# Altium schematic sheet sanati.SchDoc
size A3
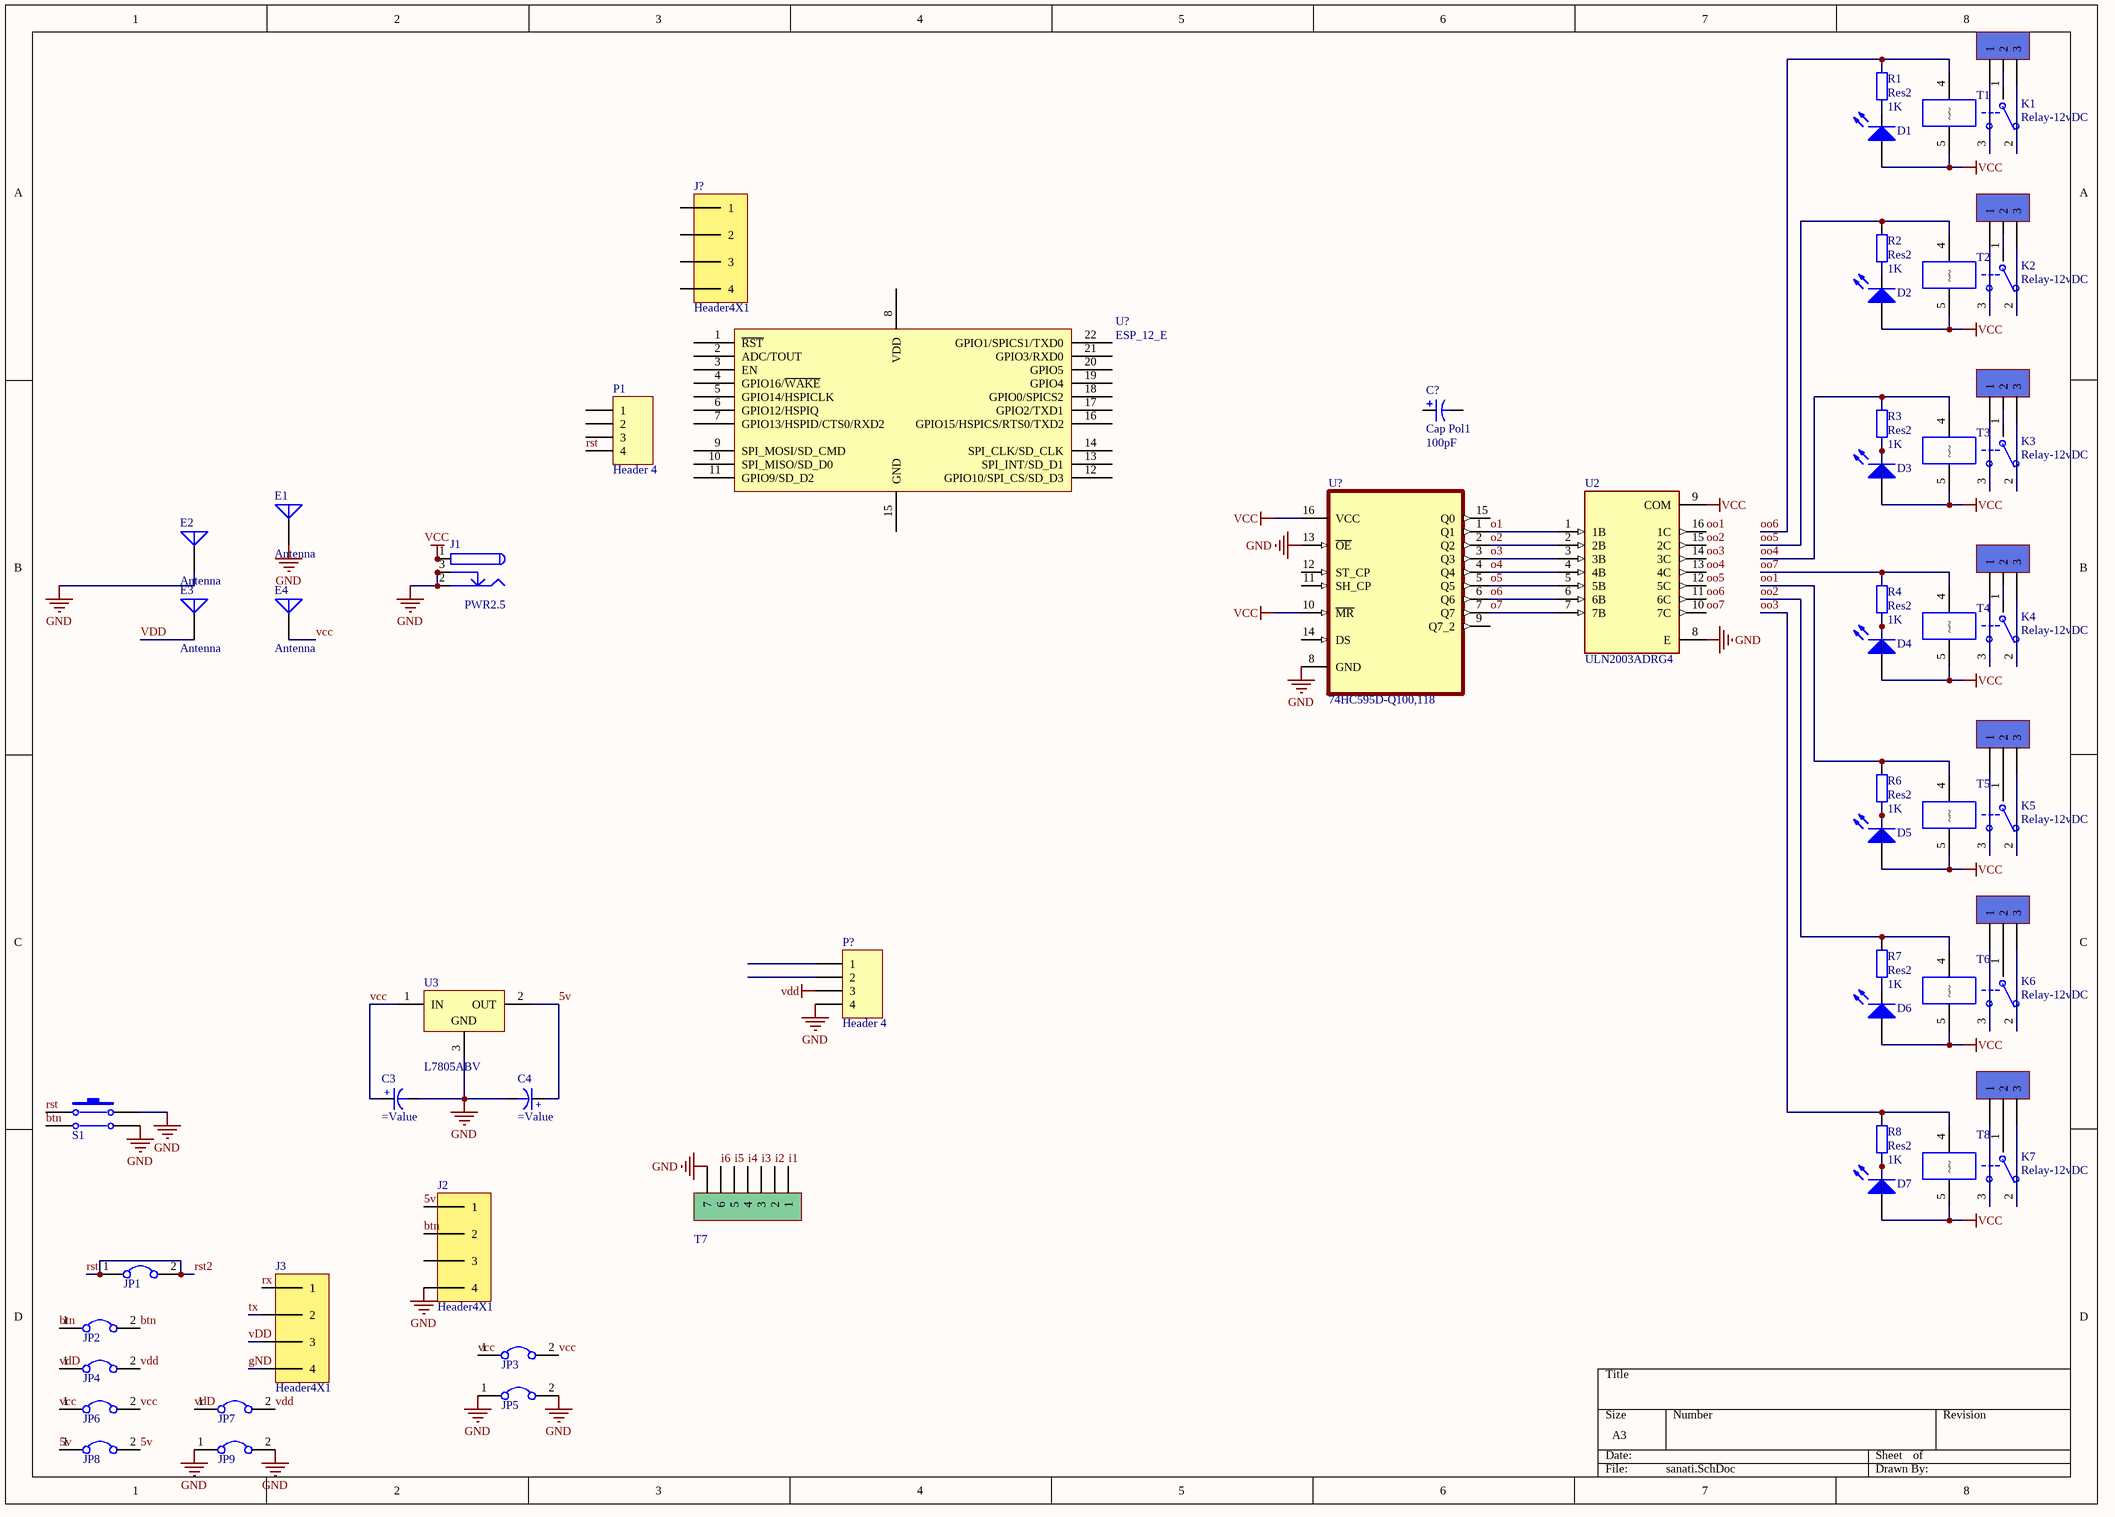
[diagram p0: sanati.SchDoc]

## Parts
(Parts that share a designator on the sheet are numbered #1, #2 ... from top to bottom, then left to right.)
C3  (no value)  [ELEC-CAP-RAD10-20]
C4  (no value)  [ELEC-CAP-RAD10-20]
C?  Cap Pol1  value 100pF  [RB7.6-15]
D1  LED 3mm  [LED-3mm]  (value not drawn)
D2  LED 3mm  [LED-3mm]  (value not drawn)
D3  LED 3mm  [LED-3mm]  (value not drawn)
D4  LED 3mm  [LED-3mm]  (value not drawn)
D5  LED 3mm  [LED-3mm]  (value not drawn)
D6  LED 3mm  [LED-3mm]  (value not drawn)
D7  LED 3mm  [LED-3mm]  (value not drawn)
E1  Antenna  [PIN1]
E2  Antenna  [PIN1]
E3  Antenna  [PIN1]
E4  Antenna  [PIN1]
J1  PWR2.5  [KLD-0202]
J2  Header4X1  [HEADER 4X1]
J3  Header4X1  [HEADER 4X1]
J?  Header4X1  [HEADER 4X1]
JP1  Jumper  [Header 2X1]  (value not drawn)
JP2  Jumper  [Header 2X1]  (value not drawn)
JP3  Jumper  [Header 2X1]  (value not drawn)
JP4  Jumper  [Header 2X1]  (value not drawn)
JP5  Jumper  [Header 2X1]  (value not drawn)
JP6  Jumper  [Header 2X1]  (value not drawn)
JP7  Jumper  [Header 2X1]  (value not drawn)
JP8  Jumper  [Header 2X1]  (value not drawn)
JP9  Jumper  [Header 2X1]  (value not drawn)
K1  Relay-12vDC  [Relays]
K2  Relay-12vDC  [Relays]
K3  Relay-12vDC  [Relays]
K4  Relay-12vDC  [Relays]
K5  Relay-12vDC  [Relays]
K6  Relay-12vDC  [Relays]
K7  Relay-12vDC  [Relays]
P1  Header 4  [HDR1X4]
P?  Header 4  [HDR1X4]
R1  Res2  value 1K  [Res50]
R2  Res2  value 1K  [Res50]
R3  Res2  value 1K  [Res50]
R4  Res2  value 1K  [Res50]
R6  Res2  value 1K  [Res50]
R7  Res2  value 1K  [Res50]
R8  Res2  value 1K  [Res50]
S1  PUSH BUTTON DOUBLE  [PUSH BUTTON]  (value not drawn)
T1  Terminal  [phoenix terminal R 3]  (value not drawn)
T2  Terminal  [phoenix terminal R 3]  (value not drawn)
T3  Terminal  [phoenix terminal R 3]  (value not drawn)
T4  Terminal  [phoenix terminal R 3]  (value not drawn)
T5  Terminal  [phoenix terminal R 3]  (value not drawn)
T6  Terminal  [phoenix terminal R 3]  (value not drawn)
T7  Phoenix terminal  [phoenix terminal 7]  (value not drawn)
T8  Terminal  [phoenix terminal R 3]  (value not drawn)
U2  ULN2003ADRG4  [SOIC127P600X175-16N]
U3  L7805ABV  [TO220ABN]
U?#1  ESP_12_E  [ESP_12_E]
U?#2  74HC595D-Q100,118  [SOIC127P600X175-16N]

## Nets
gND: C3.1(-) C4.1(-) E1.1(A) E2.1(A) J1.2 J1.2A J1.2B J1.3 J1.3A J1.3B J2.4 J3.4 JP5.1 JP5.2 JP9.1 JP9.2 P?.4 S1.2 S1.4 T7.7 U2.8(E) U3.3(GND) U?#2.8(GND) U?#2.13(~{OE})
vcc: C3.2(+) D1.1(A) D2.1(A) D3.1(A) D4.1(A) D5.1(A) D6.1(A) D7.1(A) E4.1(A) J1.1 J1.1A J1.1B JP3.1 JP3.2 JP6.1 JP6.2 K1.5 K2.5 K3.5 K4.5 K5.5 K6.5 K7.5 U2.9(COM) U3.1(IN) U?#2.10(~{MR}) U?#2.16(VCC)
VDD: E3.1(A) J3.3 JP4.1 JP4.2 JP7.1 JP7.2 P?.3
5v: C4.2(+) J2.1 JP8.1 JP8.2 U3.2(OUT)
btn: J2.2 JP2.1 JP2.2 S1.3
i1: T7.1
i2: T7.2
i3: T7.3
i4: T7.4
i5: T7.5
i6: T7.6
o1: U2.1(1B) U?#2.1(Q1)
o2: U2.2(2B) U?#2.2(Q2)
o3: U2.3(3B) U?#2.3(Q3)
o4: U2.4(4B) U?#2.4(Q4)
o5: U2.5(5B) U?#2.5(Q5)
o6: U2.6(6B) U?#2.6(Q6)
o7: U2.7(7B) U?#2.7(Q7)
oo1: K5.4 R6.2 U2.16(1C)
oo2: K6.4 R7.2 U2.15(2C)
oo3: K7.4 R8.2 U2.14(3C)
oo4: K3.4 R3.2 U2.13(4C)
oo5: K2.4 R2.2 U2.12(5C)
oo6: K1.4 R1.2 U2.11(6C)
oo7: K4.4 R4.2 U2.10(7C)
rst: JP1.1 JP1.2 P1.4 S1.1  [also labelled rst2]
rx: J3.1
tx: J3.2
NetD1_2: D1.2(K) R1.1
NetD2_2: D2.2(K) R2.1
NetD3_2: D3.2(K) R3.1
NetD4_2: D4.2(K) R4.1
NetD5_2: D5.2(K) R6.1
NetD6_2: D6.2(K) R7.1
NetD7_2: D7.2(K) R8.1
NetK1_1: K1.1(COM) T1.2
NetK1_2: K1.2(NC) T1.3
NetK1_3: K1.3(NO) T1.1
NetK2_1: K2.1(COM) T2.2
NetK2_2: K2.2(NC) T2.3
NetK2_3: K2.3(NO) T2.1
NetK3_1: K3.1(COM) T3.2
NetK3_2: K3.2(NC) T3.3
NetK3_3: K3.3(NO) T3.1
NetK4_1: K4.1(COM) T4.2
NetK4_2: K4.2(NC) T4.3
NetK4_3: K4.3(NO) T4.1
NetK5_1: K5.1(COM) T5.2
NetK5_2: K5.2(NC) T5.3
NetK5_3: K5.3(NO) T5.1
NetK6_1: K6.1(COM) T6.2
NetK6_2: K6.2(NC) T6.3
NetK6_3: K6.3(NO) T6.1
NetK7_1: K7.1(COM) T8.2
NetK7_2: K7.2(NC) T8.3
NetK7_3: K7.3(NO) T8.1

Not connected (* = marked no-connect by the designer): C? 1 2; J2 3; J? 1 2 3 4; P1 1 2 3; P? 1 2; U?#1 1(~{RST}) 2(ADC/TOUT) 3(EN) 4(GPIO16/~{WAKE}) 5(GPIO14/HSPICLK) 6(GPIO12/HSPIQ) 7(GPIO13/HSPID/CTS0/RXD2) 8(VDD) 9(SPI_MOSI/SD_CMD) 10(SPI_MISO/SD_D0) 11(GPIO9/SD_D2) 12(GPIO10/SPI_CS/SD_D3) 13(SPI_INT/SD_D1) 14(SPI_CLK/SD_CLK) 15(GND) 16(GPIO15/HSPICS/RTS0/TXD2) 17(GPIO2/TXD1) 18(GPIO0/SPICS2) 19(GPIO4) 20(GPIO5) 21(GPIO3/RXD0) 22(GPIO1/SPICS1/TXD0); U?#2 9(Q7_2) 11(SH_CP) 12(ST_CP) 14(DS) 15(Q0)

## Library data of the parts
C3 C4 = Capacitor Electrolytic: Electrolytic Capacitor
C? = Cap Pol1: Polarized Capacitor (Radial); Published: 8-Jun-2000; LatestRevisionDate: 17-Jul-2002; LatestRevisionNote: Re-released for DXP Platform.; PackageReference: RB7.6-15; Publisher: Altium Limited; PackageDescription: Polarized Capacitor (Radial); 2 Leads
D1-D7 = LED 3mm: Typical LED; Designer: Seyed Mohsen Ghasemian; Published: 02/04/2012; PackageReference: LED; Publisher: www.picpars.com; PackageDescription: LED; 2 Leads
E1-E4 = Antenna: Generic Antenna; Published: 24-Mar-1999; LatestRevisionDate: 17-Jul-2002; LatestRevisionNote: Re-released for DXP Platform.; PackageReference: PIN1; Publisher: Altium Limited
J1 = PWR2.5: Low Voltage Power Supply Connector; Published: 17-Dec-2003; DatasheetDocument: 09-May-2002; Publisher: Altium Limited; ComponentLink1Description: Manufacturer Link; ComponentLink1URL: http://domino.kycon.com/internet/Products.html
K1-K7 = Relay-05vDC: Relay-05vDC-240AC 5A; Designer: Seyed Mohsen Ghasemain; ComponentLinkURL: www.picpars.com
P1 P? = Header 4: Header, 4-Pin; LatestRevisionDate: 17-Jul-2002; LatestRevisionNote: Re-released for DXP Platform.; Publisher: Altium Limited
R1-R4 R6-R8 = Res2: Resistor; Published: 8-Jun-2000; LatestRevisionDate: 17-Jul-2002; LatestRevisionNote: Re-released for DXP Platform.; Publisher: Altium Limited; PackageDescription: Axial Device, Thru-Hole; 2 Leads; 0.4 in Pin Spacing
  R1-R4 R6 R7: PackageReference: AXIAL-0.4
  R8: PackageReference: Res50
S1 = PUSH BUTTON DOUBLE: Switch
T1-T6 T8 = Terminal 1*3: phoenix terminal R 3; Designer: Seyed Mohsen Ghasemain; E-mail: picpars@gmail.com; ComponentLinkURL: www.picpars.com
T7 = Phoenix terminal 7: Terminal 7 Pin; Designer: Seyed Mohsen Ghasemain; E-mail: picpars@gmail.com; ComponentLinkURL: www.picpars.com
U2 = ULN2003ADRG4: 50-V, 7-ch darlington transistor array, -20C to 70C 16-SOIC -40 to 70; Price: None; MP: ULN2003ADRG4; Availability: Unavailable; Package: None; Value: *
U3 = L7805ABV: Precision 1A Regulator; Note: Tab is connected to pin 3 (GND).; Published: 24-Aug-2001; LatestRevisionDate: 17-Jul-2002; LatestRevisionNote: Re-released for DXP Platform.; DatasheetVersion: Nov-1999; PackageVersion: Jun-1998; PackageReference: TO220ABN; Publisher: Altium Limited; PackageDescription: TO, Thru-Hole, Vertical, Heatsink Mounted; 3 In-Line Leads; Pitch 2.54 mm; Pin sequence 1, 3, 2; ComponentLink1Description: Manufacturer Link; ComponentLink1URL: http://www.st.com/; ComponentLink2Description: Datasheet; ComponentLink2URL: http://www.st.com/stonline/products/literature/ds/2144/l7805ab.pdf
U?#1 = ESP_12_E: ESP-12 Wi-Fi Module by AI-Thinker; IC: ESP8266-EX; Vendor: Ai-thinker
U?#2 = 74HC595D-Q100,118: Shift Shift Register 1 Element 8 Bit 16-SO; MF: Nexperia USA; Check_prices: https://www.snapeda.com/parts/74HC595D-Q100,118/Nexperia/view-part/1041587/?ref=eda; SnapEDA_Link: https://www.snapeda.com/parts/74HC595D-Q100,118/Nexperia/view-part/1041587/?ref=snap; Price: None; MP: 74HC595D-Q100,118; Value: *; Availability: Warning; Package: SO16-16 Nexperia USA Inc.; Purchase-URL: https://pricing.snapeda.com/search/part/74HC595D-Q100,118/?ref=eda